# EAGLE schematic final_project v6 (EAGLE 9.7.0)
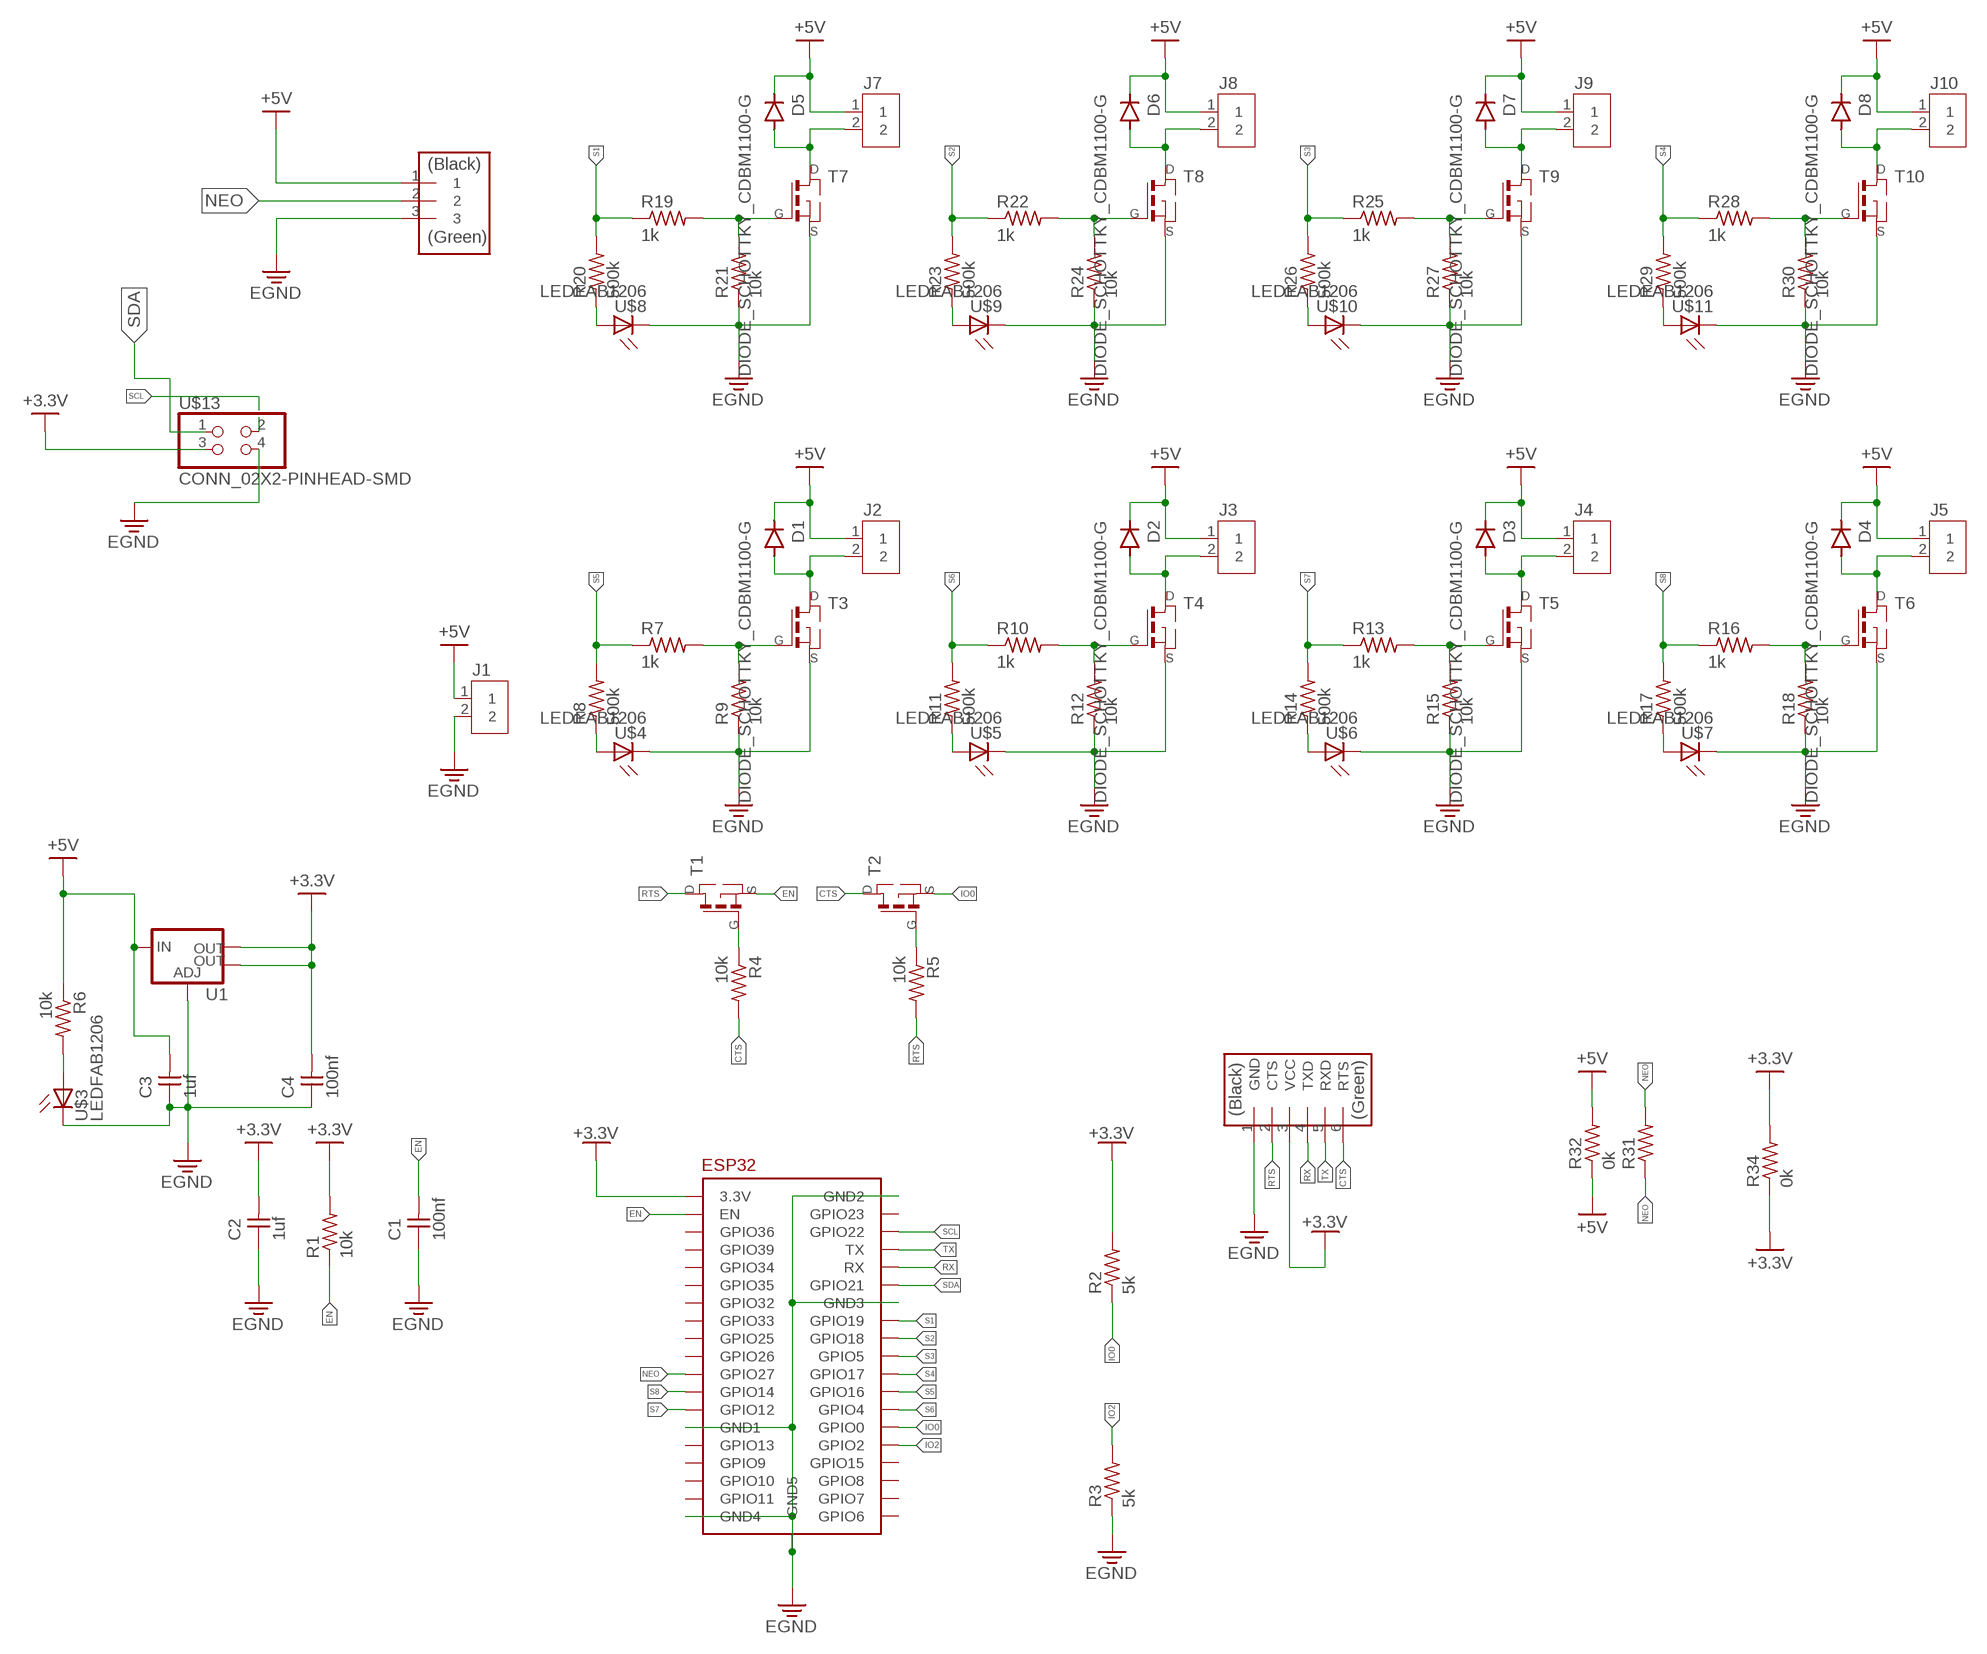
[diagram p0: schematic, sheet 1]

## Parts
C1  100nf  CAP_UNPOLARIZEDFAB  [C1206FAB]
C2  1uf  CAP_UNPOLARIZEDFAB  [C1206FAB]
C3  1uf  CAP_UNPOLARIZEDFAB  [C1206FAB]
C4  100nf  CAP_UNPOLARIZEDFAB  [C1206FAB]
D1  DIODE_SCHOTTKY_CDBM1100-G  [MINI-SMA]
D2  DIODE_SCHOTTKY_CDBM1100-G  [MINI-SMA]
D3  DIODE_SCHOTTKY_CDBM1100-G  [MINI-SMA]
D4  DIODE_SCHOTTKY_CDBM1100-G  [MINI-SMA]
D5  DIODE_SCHOTTKY_CDBM1100-G  [MINI-SMA]
D6  DIODE_SCHOTTKY_CDBM1100-G  [MINI-SMA]
D7  DIODE_SCHOTTKY_CDBM1100-G  [MINI-SMA]
D8  DIODE_SCHOTTKY_CDBM1100-G  [MINI-SMA]
J1  2828XX-2282837-2  [TERMBLK_508-2N]
J2  2828XX-2282837-2  [TERMBLK_508-2N]
J3  2828XX-2282837-2  [TERMBLK_508-2N]
J4  2828XX-2282837-2  [TERMBLK_508-2N]
J5  2828XX-2282837-2  [TERMBLK_508-2N]
J7  2828XX-2282837-2  [TERMBLK_508-2N]
J8  2828XX-2282837-2  [TERMBLK_508-2N]
J9  2828XX-2282837-2  [TERMBLK_508-2N]
J10  2828XX-2282837-2  [TERMBLK_508-2N]
R1  10k  R1206FAB  [R1206FAB]
R2  5k  R1206FAB  [R1206FAB]
R3  5k  R1206FAB  [R1206FAB]
R4  10k  R1206FAB  [R1206FAB]
R5  10k  R1206FAB  [R1206FAB]
R6  10k  R1206FAB  [R1206FAB]
R7  1k  R1206FAB  [R1206FAB]
R8  500k  R1206FAB  [R1206FAB]
R9  10k  R1206FAB  [R1206FAB]
R10  1k  R1206FAB  [R1206FAB]
R11  500k  R1206FAB  [R1206FAB]
R12  10k  R1206FAB  [R1206FAB]
R13  1k  R1206FAB  [R1206FAB]
R14  500k  R1206FAB  [R1206FAB]
R15  10k  R1206FAB  [R1206FAB]
R16  1k  R1206FAB  [R1206FAB]
R17  500k  R1206FAB  [R1206FAB]
R18  10k  R1206FAB  [R1206FAB]
R19  1k  R1206FAB  [R1206FAB]
R20  500k  R1206FAB  [R1206FAB]
R21  10k  R1206FAB  [R1206FAB]
R22  1k  R1206FAB  [R1206FAB]
R23  500k  R1206FAB  [R1206FAB]
R24  10k  R1206FAB  [R1206FAB]
R25  1k  R1206FAB  [R1206FAB]
R26  500k  R1206FAB  [R1206FAB]
R27  10k  R1206FAB  [R1206FAB]
R28  1k  R1206FAB  [R1206FAB]
R29  500k  R1206FAB  [R1206FAB]
R30  10k  R1206FAB  [R1206FAB]
R31  0k  R1206FAB  [R1206FAB]
R32  0k  R1206FAB  [R1206FAB]
R34  0k  R1206FAB  [R1206FAB]
T1  MOSFET_NSOT23  [SOT-23]
T2  MOSFET_NSOT23  [SOT-23]
T3  MOSFET_NSOT23  [SOT-23]
T4  MOSFET_NSOT23  [SOT-23]
T5  MOSFET_NSOT23  [SOT-23]
T6  MOSFET_NSOT23  [SOT-23]
T7  MOSFET_NSOT23  [SOT-23]
T8  MOSFET_NSOT23  [SOT-23]
T9  MOSFET_NSOT23  [SOT-23]
T10  MOSFET_NSOT23  [SOT-23]
U1  VR_REGULATOR_LM1117SOT223  [SOT223]
U$1  ESP32-WROOM  [ESP32-WROOM-WITH_3D]
U$2  CONN_06_FTDI-SMD-HEADER  CONN_06_FTDI-SMD-HEADER_2SIDE  [1X06SMD(2_ROW)]
U$3  LEDFAB1206  [LED1206FAB]
U$4  LEDFAB1206  [LED1206FAB]
U$5  LEDFAB1206  [LED1206FAB]
U$6  LEDFAB1206  [LED1206FAB]
U$7  LEDFAB1206  [LED1206FAB]
U$8  LEDFAB1206  [LED1206FAB]
U$9  LEDFAB1206  [LED1206FAB]
U$10  LEDFAB1206  [LED1206FAB]
U$11  LEDFAB1206  [LED1206FAB]
U$13  CONN_02X2-PINHEAD-SMD  [2X02SMD]
U$14  CONN_03-SMD-HEADER_2SIDE  [1X03SMD(2_ROW)]

## Nets
+3.3V: C2.2 C4.2 R1.2 R2.2 R34.1 R34.2 U1.2(OUT) U1.4(OUT) U$1.3V3(3.3V) U$2.3(VCC) U$13.3
CTS: R4.2 T2.1(D) U$2.6(RTS)
EGND: C1.1 C2.1 C3.1 C4.1 J1.2 R3.1 R9.1 R12.1 R15.1 R18.1 R21.1 R24.1 R27.1 R30.1 T3.2(S) T4.2(S) T5.2(S) T6.2(S) T7.2(S) T8.2(S) T9.2(S) T10.2(S) U1.1(ADJ) U$1.GND1 U$1.GND2 U$1.GND3 U$1.GND4 U$1.GND5 U$2.1(GND) U$3.2(C) U$4.2(C) U$5.2(C) U$6.2(C) U$7.2(C) U$8.2(C) U$9.2(C) U$10.2(C) U$11.2(C) U$13.4 U$14.3
EN: C1.2 R1.1 T1.2(S) U$1.EN
IO0: R2.1 T2.2(S) U$1.IO0(GPIO0)
IO2: R3.2 U$1.IO2(GPIO2)
N$1: R6.2 U$3.1(A)
N$2: R4.1 T1.3(G)
N$4: R5.1 T2.3(G)
N$5: R7.2 R9.2 T3.3(G)
N$6: R8.1 U$4.1(A)
N$7: D1.ANODE J2.2 T3.1(D)
N$9: R10.2 R12.2 T4.3(G)
N$10: D2.ANODE J3.2 T4.1(D)
N$11: R11.1 U$5.1(A)
N$13: R13.2 R15.2 T5.3(G)
N$14: D3.ANODE J4.2 T5.1(D)
N$15: R14.1 U$6.1(A)
N$17: R16.2 R18.2 T6.3(G)
N$18: D4.ANODE J5.2 T6.1(D)
N$19: R17.1 U$7.1(A)
N$21: R19.2 R21.2 T7.3(G)
N$22: D5.ANODE J7.2 T7.1(D)
N$23: R20.1 U$8.1(A)
N$25: R22.2 R24.2 T8.3(G)
N$26: D6.ANODE J8.2 T8.1(D)
N$27: R23.1 U$9.1(A)
N$29: R25.2 R27.2 T9.3(G)
N$30: D7.ANODE J9.2 T9.1(D)
N$31: R26.1 U$10.1(A)
N$33: R28.2 R30.2 T10.3(G)
N$34: D8.ANODE J10.2 T10.1(D)
N$35: R29.1 U$11.1(A)
NEO: R31.1 R31.2 U$1.IO27(GPIO27) U$14.2
RTS: R5.2 T1.1(D) U$2.2(CTS)
RX: U$1.RX U$2.4(TXD)
S1: R19.1 R20.2 U$1.IO19(GPIO19)
S2: R22.1 R23.2 U$1.IO18(GPIO18)
S3: R25.1 R26.2 U$1.IO5(GPIO5)
S4: R28.1 R29.2 U$1.IO17(GPIO17)
S5: R7.1 R8.2 U$1.IO16(GPIO16)
S6: R10.1 R11.2 U$1.IO4(GPIO4)
S7: R13.1 R14.2 U$1.IO12(GPIO12)
S8: R16.1 R17.2 U$1.IO14(GPIO14)
SCL: U$1.IO22(GPIO22) U$13.2
SDA: U$1.IO21(GPIO21) U$13.1
TX: U$1.TX U$2.5(RXD)
VCC: C3.2 D1.KATHODE D2.KATHODE D3.KATHODE D4.KATHODE D5.KATHODE D6.KATHODE D7.KATHODE D8.KATHODE J1.1 J2.1 J3.1 J4.1 J5.1 J7.1 J8.1 J9.1 J10.1 R6.1 R32.1 R32.2 U1.3(IN) U$14.1 ; supply symbol labelled +5V
Unconnected: U$1.CLK(GPIO6) U$1.CMD(GPIO11) U$1.IO13(GPIO13) U$1.IO15(GPIO15) U$1.IO23(GPIO23) U$1.IO25(GPIO25) U$1.IO26(GPIO26) U$1.IO32(GPIO32) U$1.IO33(GPIO33) U$1.IO34(GPIO34) U$1.IO35(GPIO35) U$1.SD0(GPIO7) U$1.SD1(GPIO8) U$1.SD2(GPIO9) U$1.SD3(GPIO10) U$1.SENSOR_VN(GPIO39) U$1.SENSOR_VP(GPIO36)

## Library data of the parts
C1-C4 = fab_JEJ:CAP_UNPOLARIZED
D1-D8 = fab_JEJ:DIODE_SCHOTTKY_CDBM1100-G: Diode schottky 100V 1A mini-SMA as found in the fablab inventory Reverse Voltage: 100 Volts Forward Current: 1.0 Amp Maximum forward voltage: 0.85 Volts Made by Zaerc.
J1-J5 J7-J10 = Connector:2828XX-2: 2 Position Wire to Board Terminal Block Horizontal with Board Datasheet <https://www.te.com.cn/commerce/DocumentDelivery/DDEController?Action=showdoc&DocId=Catalog+Section%7F1308389_EUROSTYLE_TERMINAL_BLOCKS%7F0607%7Fpdf%7FEnglish%7FENG_CS_1308389_EUROSTYLE_TERMINAL_BLOCKS_0607.pdf%7F2-282837-5>; CATEGORY: Connector; DESCRIPTION: 2 Position Wire to Board Terminal Block Horizontal with Board 5.08 mm Through Hole; MANUFACTURER: TE Connectivity; MPN: 282837-2; OPERATING_TEMPERATURE: -40°C to +105°C; PART_STATUS: ACTIVE; ROHS_COMPLIANCE: RoHS Compliant; SERIES: 282837; SUBCATEGORY: Terminal Block; TYPE: Side Wire Entry
R1-R32 R34 = fab_JEJ:R: Resistor (US Symbol) Variants with postfix FAB are widened to allow the routing of internal traces
T1-T10 = fab_JEJ:MOSFET_N: MOS FET
U1 = fab_JEJ:VR_REGULATOR_LM1117: Voltage Regulator LM1117 Standard adjustable voltage regulator but in SMD form. Spark Fun Electronics SKU : COM-00595; PROD_ID: VREG-08170
U$1 = fab_JEJ:ESP32-WROOM
U$2 = fab_JEJ:CONN_06_FTDI-SMD-HEADER_2SIDE
U$3-U$11 = fab_JEJ:LED: LED
U$13 = fab_JEJ:CONN_02X2-PINHEAD-SMD
U$14 = fab_JEJ:CONN_03-SMD-HEADER_2SIDE